# EAGLE design dual-basler-shield-v2 (EAGLE 9.2.2)
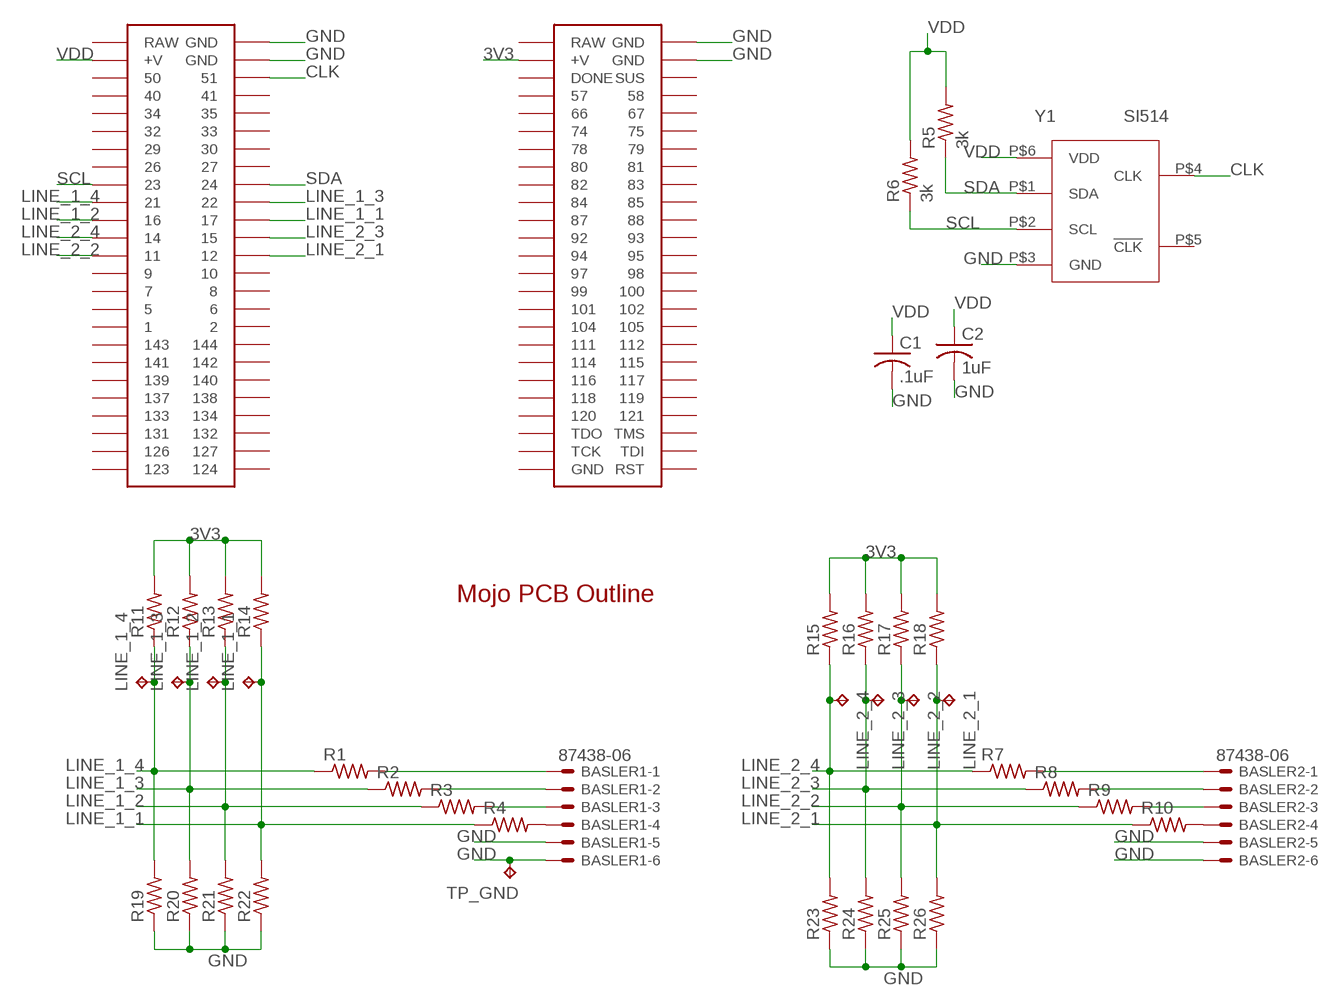
[diagram p0: schematic, sheet 1]

## Parts
BASLER1  87438-06  [87438-06]
BASLER2  87438-06  [87438-06]
C1  .1uF  C-USC0603  [C0603]
C2  1uF  C-USC0603  [C0603]
LINE_1_1  TPTP16R  [TP16R]
LINE_1_2  TPTP16R  [TP16R]
LINE_1_3  TPTP16R  [TP16R]
LINE_1_4  TPTP16R  [TP16R]
LINE_2_1  TPTP16R  [TP16R]
LINE_2_2  TPTP16R  [TP16R]
LINE_2_3  TPTP16R  [TP16R]
LINE_2_4  TPTP16R  [TP16R]
R1  R-US_R0603  [R0603]
R2  R-US_R0603  [R0603]
R3  R-US_R0603  [R0603]
R4  R-US_R0603  [R0603]
R5  3k  R-US_R0603  [R0603]
R6  3k  R-US_R0603  [R0603]
R7  R-US_R0603  [R0603]
R8  R-US_R0603  [R0603]
R9  R-US_R0603  [R0603]
R10  R-US_R0603  [R0603]
R11  R-US_R0603  [R0603]
R12  R-US_R0603  [R0603]
R13  R-US_R0603  [R0603]
R14  R-US_R0603  [R0603]
R15  R-US_R0603  [R0603]
R16  R-US_R0603  [R0603]
R17  R-US_R0603  [R0603]
R18  R-US_R0603  [R0603]
R19  R-US_R0603  [R0603]
R20  R-US_R0603  [R0603]
R21  R-US_R0603  [R0603]
R22  R-US_R0603  [R0603]
R23  R-US_R0603  [R0603]
R24  R-US_R0603  [R0603]
R25  R-US_R0603  [R0603]
R26  R-US_R0603  [R0603]
TP_GND  TPTP16R  [TP16R]
U$3  MOJO_OUTLINE  [MOJO_OUTLINE]
U$4  MOJOV3  [MOJO_V3]
Y1  SI514  [XTAL-6PIN]

## Nets
3V3: R11.2 R12.2 R13.2 R14.2 R15.2 R16.2 R17.2 R18.2 U$4.V@2(+V)
CLK: U$4.51 Y1.P$4(CLK)
GND: BASLER1.5 BASLER1.6 BASLER2.5 BASLER2.6 C1.2 C2.2 R19.1 R20.1 R21.1 R22.1 R23.1 R24.1 R25.1 R26.1 TP_GND.TP U$4.GND@1(GND) U$4.GND@2(GND) U$4.GND@3(GND) U$4.GND@4(GND) Y1.P$3(GND)
LINE_1_1: LINE_1_1.TP R4.1 R14.1 R22.2 U$4.17
LINE_1_2: LINE_1_2.TP R3.1 R13.1 R21.2 U$4.16
LINE_1_3: LINE_1_3.TP R2.1 R12.1 R20.2 U$4.22
LINE_1_4: LINE_1_4.TP R1.1 R11.1 R19.2 U$4.21
LINE_2_1: LINE_2_1.TP R10.1 R18.1 R26.2 U$4.12
LINE_2_2: LINE_2_2.TP R9.1 R17.1 R25.2 U$4.11
LINE_2_3: LINE_2_3.TP R8.1 R16.1 R24.2 U$4.15
LINE_2_4: LINE_2_4.TP R7.1 R15.1 R23.2 U$4.14
N$1: BASLER1.1 R1.2
N$2: BASLER1.2 R2.2
N$3: BASLER1.3 R3.2
N$4: BASLER1.4 R4.2
N$5: BASLER2.1 R7.2
N$6: BASLER2.2 R8.2
N$7: BASLER2.3 R9.2
N$8: BASLER2.4 R10.2
SCL: R6.1 U$4.23 Y1.P$2(SCL)
SDA: R5.1 U$4.24 Y1.P$1(SDA)
VDD: C1.1 C2.1 R5.2 R6.2 U$4.V@1(+V) Y1.P$6(VDD)
Unconnected: U$4.1 U$4.2 U$4.5 U$4.6 U$4.7 U$4.8 U$4.9 U$4.10 U$4.26 U$4.27 U$4.29 U$4.30 U$4.32 U$4.33 U$4.34 U$4.35 U$4.40 U$4.41 U$4.50 U$4.57 U$4.58 U$4.66 U$4.67 U$4.74 U$4.75 U$4.78 U$4.79 U$4.80 U$4.81 U$4.82 U$4.83 U$4.84 U$4.85 U$4.87 U$4.88 U$4.92 U$4.93 U$4.94 U$4.95 U$4.97 U$4.98 U$4.99 U$4.100 U$4.101 U$4.102 U$4.104 U$4.105 U$4.111 U$4.112 U$4.114 U$4.115 U$4.116 U$4.117 U$4.118 U$4.119 U$4.120 U$4.121 U$4.123 U$4.124 U$4.126 U$4.127 U$4.131 U$4.132 U$4.133 U$4.134 U$4.137 U$4.138 U$4.139 U$4.140 U$4.141 U$4.142 U$4.143 U$4.144 U$4.A0 U$4.A1 U$4.A4 U$4.A5 U$4.A6 U$4.A7 U$4.A8 U$4.A9 U$4.AREF U$4.DONE U$4.GND@5(GND) U$4.GND@6(GND) U$4.RAW@1(RAW) U$4.RAW@2(RAW) U$4.RST U$4.SUS U$4.TCK U$4.TDI U$4.TDO U$4.TMS Y1.P$5(!CLK)

## Library data of the parts
BASLER1 BASLER2 = con-molex:87438-06: Wire-to-Board 1.50mm (.059") Pitch Header - Right Angle, SMT, Shrouded Source: http://www.molex.com/product/micro/87438.html; MF: MOLEX; MPN: 87438-0643; OC_FARNELL: 1756938; OC_NEWARK: 88K3155
C1 C2 = rcl:C-US: CAPACITOR, American symbol; SPICEPREFIX: C
LINE_1_1-LINE_1_4 LINE_2_1-LINE_2_4 TP_GND = testpad:TP: Test pad
R1-R26 = rcl:R-US_: RESISTOR, American symbol; SPICEPREFIX: R
U$3 = EmbeddedMicro-Mojo:MOJO_OUTLINE
U$4 = EmbeddedMicro-Mojo:MOJO
Y1 = lupa300-components:SI514

## Board
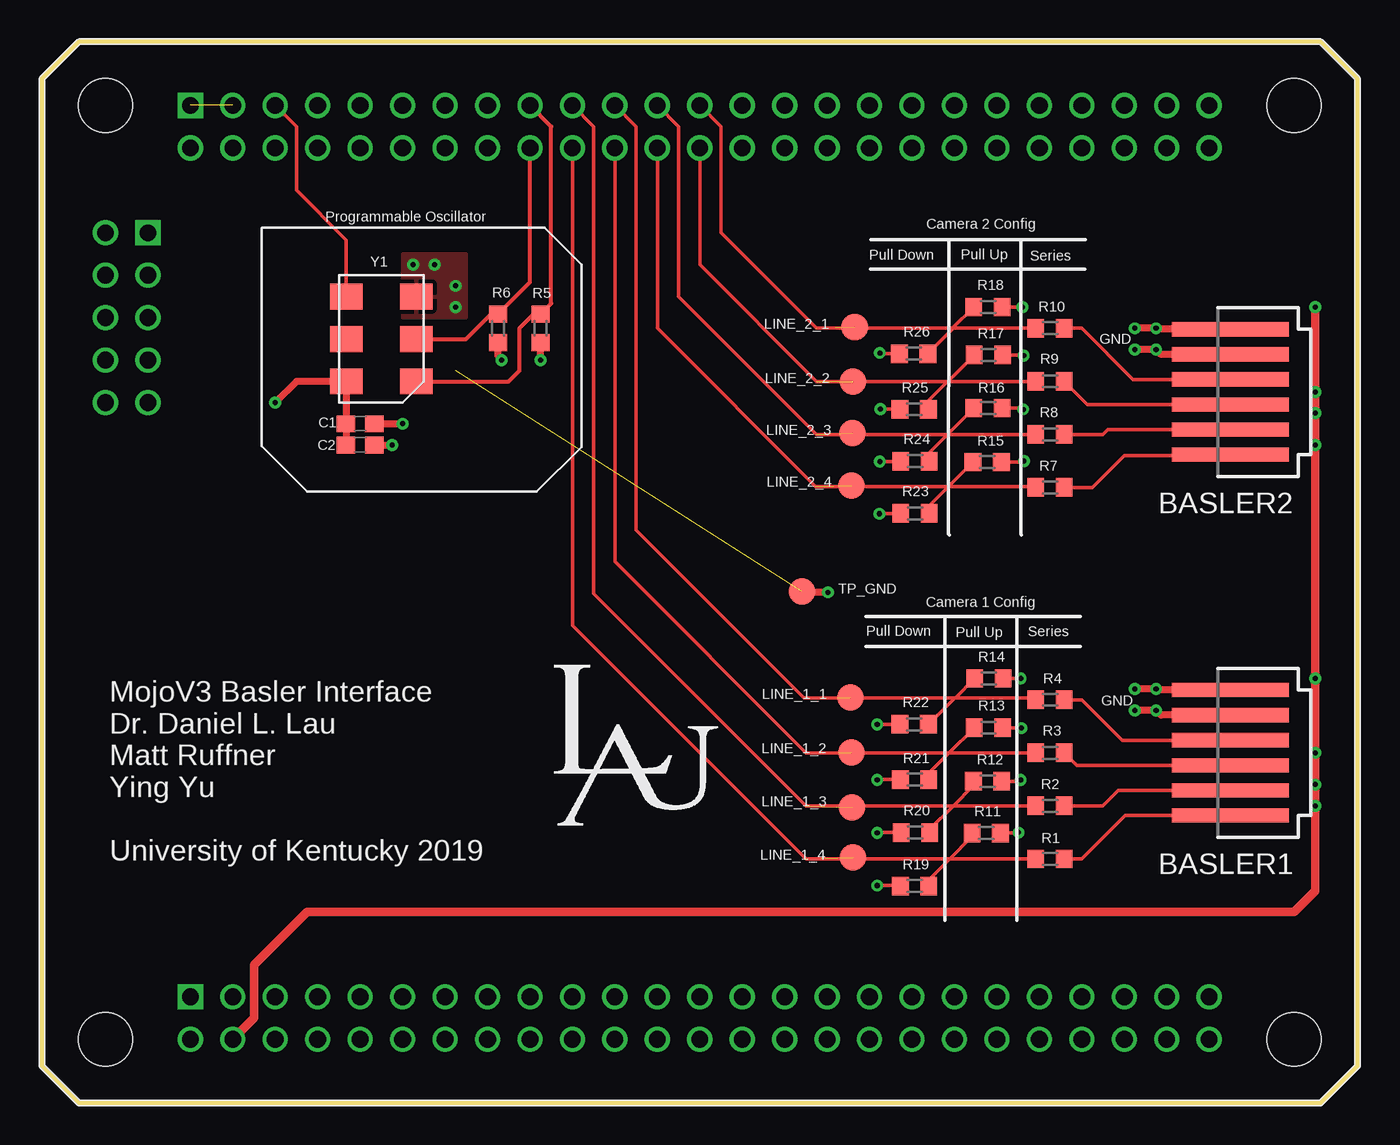
[diagram p1: board, top side]
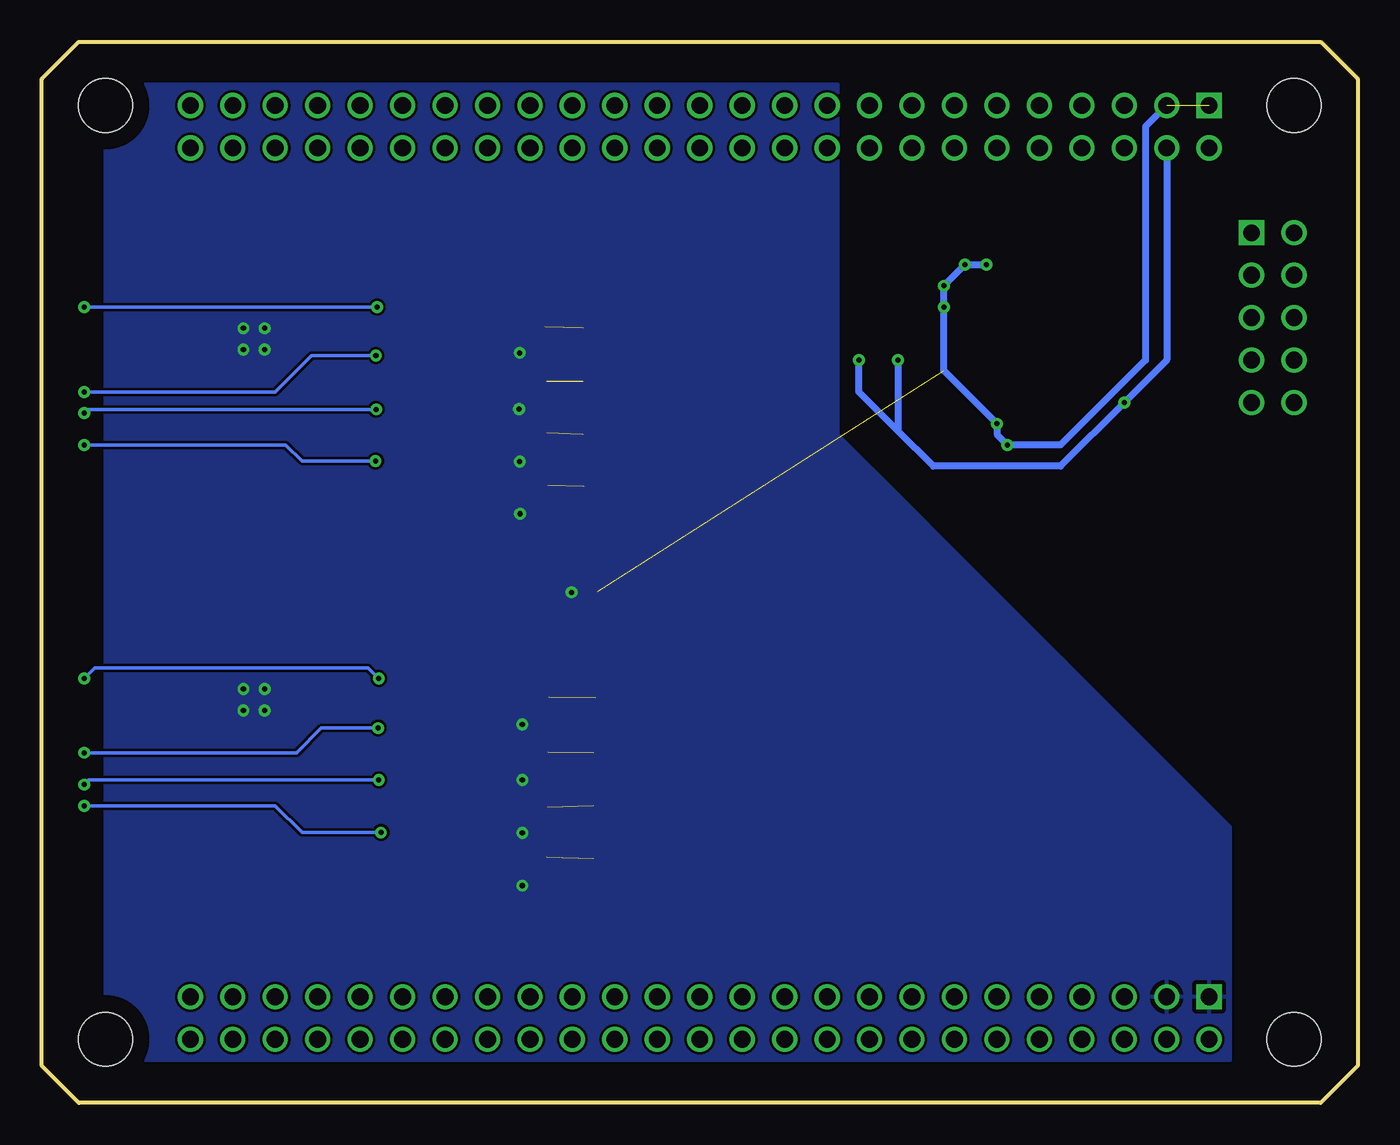
[diagram p2: board, bottom side, seen from below]

Size 78.74 x 63.5 mm. Coordinates in mm from the lower left corner, seen from the top.
Outline: 2.22,0 76.52,0 78.74,2.22 78.74,61.28 76.52,63.5 2.22,63.5 0,61.28 0,2.22 2.22,0
Copper layers (1*16): Top 0.035mm / dielectric 1.5mm / Bottom 0.035mm
Design rules "default *": minimum track width 6mil, minimum drill 0.35mm, track to track 6mil, track to pad 6mil, pad to pad 6mil, via to via 6mil, smd to smd 6mil, copper to edge 40mil, drill to drill 6mil, minimum pad ring 10mil, minimum via ring 8mil, stop-mask expansion 4mil, vias tented up to drill 12mil, thermal gap 10mil

### Footprints (pad centres in the part's own frame; a part is rotated, then mirrored left to right if it is on the bottom)
87438-06 = smd 7 x 0.85: 1 0,3.75; 2 0,2.25; 3 0,0.75; 4 0,-0.75; 5 0,-2.25; 6 0,-3.75
C0603 = smd 1.1 x 1: 1 -0.85,0; 2 0.85,0
TP16R = smd 1.6 x 1.6: TP 0,0
R0603 = smd 1 x 1.1: 1 -0.85,0; 2 0.85,0
MOJO_V3 = drill 1: 1 49.53,57.15; 2 49.53,59.69; 5 46.99,57.15; 6 46.99,59.69; 7 44.45,57.15; 8 44.45,59.69; 9 41.91,57.15; 10 41.91,59.69; 11 39.37,57.15; 12 39.37,59.69; 14 36.83,57.15; 15 36.83,59.69; 16 34.29,57.15; 17 34.29,59.69; 21 31.75,57.15; 22 31.75,59.69; 23 29.21,57.15; 24 29.21,59.69; 26 26.67,57.15; 27 26.67,59.69; 29 24.13,57.15; 30 24.13,59.69; 32 21.59,57.15; 33 21.59,59.69; 34 19.05,57.15; 35 19.05,59.69; 40 16.51,57.15; 41 16.51,59.69; 50 13.97,57.15; 51 13.97,59.69; 57 16.51,3.81; 58 16.51,6.35; 66 19.05,3.81; 67 19.05,6.35; 74 21.59,3.81; 75 21.59,6.35; 78 24.13,3.81; 79 24.13,6.35; 80 26.67,3.81; 81 26.67,6.35; 82 29.21,3.81; 83 29.21,6.35; 84 31.75,3.81; 85 31.75,6.35; 87 34.29,3.81; 88 34.29,6.35; 92 36.83,3.81; 93 36.83,6.35; 94 39.37,3.81; 95 39.37,6.35; 97 41.91,3.81; 98 41.91,6.35; 99 44.45,3.81; 100 44.45,6.35; 101 46.99,3.81; 102 46.99,6.35; 104 49.53,3.81; 105 49.53,6.35; 111 52.07,3.81; 112 52.07,6.35; 114 54.61,3.81; 115 54.61,6.35; 116 57.15,3.81; 117 57.15,6.35; 118 59.69,3.81; 119 59.69,6.35; 120 62.23,3.81; 121 62.23,6.35; 123 69.85,57.15; 124 69.85,59.69; 126 67.31,57.15; 127 67.31,59.69; 131 64.77,57.15; 132 64.77,59.69; 133 62.23,57.15; 134 62.23,59.69; 137 59.69,57.15; 138 59.69,59.69; 139 57.15,57.15; 140 57.15,59.69; 141 54.61,57.15; 142 54.61,59.69; 143 52.07,57.15; 144 52.07,59.69; A0 6.35,41.91; A1 3.81,41.91; A4 6.35,44.45; A5 3.81,44.45; A6 6.35,46.99; A7 3.81,46.99; A8 6.35,49.53; A9 3.81,49.53; AREF 3.81,52.07; DONE 13.97,3.81; GND@2 11.43,59.69; GND@4 11.43,6.35; GND@6 69.85,3.81; RAW@1 8.89,57.15; RAW@2 8.89,3.81; RST 69.85,6.35; SUS 13.97,6.35; TCK 67.31,3.81; TDI 67.31,6.35; TDO 64.77,3.81; TMS 64.77,6.35; V@1 11.43,57.15; V@2 11.43,3.81 | drill 1 square: GND@1 8.89,59.69; GND@3 8.89,6.35; GND@5 6.35,52.07 | hole 3.2: 3.81,3.81; 3.81,59.69; 74.93,59.69; 74.93,3.81
XTAL-6PIN = smd 1.95 x 1.55: P$1 -2.1,2.54; P$2 -2.1,0; P$3 -2.1,-2.54; P$4 2.1,-2.54; P$5 2.1,0; P$6 2.1,2.54

### Placement (x,y rotation side)
BASLER1  71.12,20.95 180 top
BASLER2  71.12,42.55 180 top
C1  19.05,40.64 0 top
C2  19.05,39.37 0 top
LINE_1_1  48.39,24.26 0 top
LINE_1_2  48.44,20.98 0 top
LINE_1_3  48.46,17.68 0 top
LINE_1_4  48.54,14.68 0 top
LINE_2_1  48.64,46.43 0 top
LINE_2_2  48.54,43.18 0 top
LINE_2_3  48.51,40.08 0 top
LINE_2_4  48.44,36.96 0 top
R1  60.33,14.61 0 top
R2  60.33,17.78 0 top
R3  60.33,20.95 0 top
R4  60.33,24.13 0 top
R5  29.84,46.35 270 top
R6  27.3,46.35 270 top
R7  60.33,36.83 0 top
R8  60.33,40.01 0 top
R9  60.33,43.18 0 top
R10  60.33,46.35 0 top
R11  56.52,16.15 0 top
R12  56.59,19.25 0 top
R13  56.64,22.45 0 top
R14  56.67,25.4 0 top
R15  56.57,38.35 0 top
R16  56.62,41.58 0 top
R17  56.64,44.76 0 top
R18  56.62,47.62 0 top
R19  52.22,12.98 0 top
R20  52.27,16.18 0 top
R21  52.22,19.36 0 top
R22  52.2,22.66 0 top
R23  52.25,35.28 0 top
R24  52.25,38.41 0 top
R25  52.2,41.5 0 top
R26  52.17,44.83 0 top
TP_GND  45.49,30.61 0 top
U$3  0,0 0 top
U$4  0,0 0 top
Y1  20.32,45.72 180 top

### Tracks (layer width: path | path; a pad name or v marks a point on that pad's centre or on a via)
3V3  (via drill 0.3)
  Top 0.203: v58.67,47.62 R18.2 | R14.2 v58.57,25.4 | R13.2 58.6,22.45 v58.62,22.43 | R12.2 58.5,19.25 v58.57,19.33 | R11.2 58.42,16.15 v58.45,16.18 | R17.2 58.73,44.76 v58.75,44.73 | R16.2 58.65,41.58 v58.73,41.5 | R15.2 58.73,38.35 v58.78,38.41
  Top 0.508: U$4.V@2 12.7,5.08 12.7,8.26 15.88,11.43 74.93,11.43 76.2,12.7 v76.2,17.78 v76.2,19.05 v76.2,20.95 v76.2,25.4 v76.2,39.37 v76.2,41.27 v76.2,42.55 v76.2,47.62
  Bottom 0.203: v76.2,47.62 v58.67,47.62 | v58.75,44.73 62.59,44.73 64.77,42.55 v76.2,42.55 | v76.2,41.27 75.97,41.5 v58.73,41.5 | v76.2,39.37 64.14,39.37 63.17,38.41 v58.78,38.41 | v58.57,25.4 59.21,26.04 75.56,26.04 v76.2,25.4 | v58.62,22.43 62.03,22.43 63.5,20.95 v76.2,20.95 | v76.2,19.05 75.92,19.33 v58.57,19.33 | v58.45,16.18 63.17,16.18 64.77,17.78 v76.2,17.78
CLK
  Top 0.203: Y1.P$4 18.22,51.63 15.24,54.61 15.24,58.42 U$4.51
GND  (via drill 0.3)  (2 unrouted)
  Top 0.203: R26.1 50.19,44.83 v50.14,44.88 | R23.1 50.14,35.28 v50.11,35.26 | R24.1 51.37,38.38 v50.14,38.38 | R25.1 51.32,41.53 v50.19,41.53 | R22.1 v49.99,22.66 | R21.1 50.01,19.36 v49.99,19.33 | R20.1 50.01,16.18 v49.99,16.15 | R19.1 51.35,13.01 v49.99,13.01
  Top 0.406: C1.2 v21.59,40.64 | C2.2 v20.95,39.37 | BASLER2.6 66.73,46.3 v66.67,46.35 v65.41,46.35 | BASLER2.5 66.97,44.8 v66.67,45.09 v65.41,45.09 | BASLER1.6 66.73,24.7 v66.67,24.77 v65.41,24.77 | BASLER1.5 66.97,23.2 v66.67,23.5 v65.41,23.5 | v47.04,30.56 46.15,30.56 46.1,30.61 TP_GND.TP
  Bottom 0.406: U$4.GND@2 12.7,58.42 12.7,44.45 17.78,39.37 v20.95,39.37 21.59,40.01 v21.59,40.64 24.77,43.81 v24.77,47.62 v24.77,48.9 v23.5,50.16 v22.23,50.16
  pour Top: 21.59,46.99 25.4,46.99 25.4,50.8 21.59,50.8
  pour Bottom: 7.62,16.51 7.62,2.54 74.93,2.54 74.93,60.96 31.11,60.96 31.11,40.01
LINE_1_1  (1 unrouted)
  Top 0.203: U$4.17 35.56,58.42 35.56,34.29 45.6,24.25 54.63,24.25 | R4.1 59.36,24.25 54.66,24.25 | R14.1 54.66,24.25 | R22.2 54.63,24.25 | 54.63,24.25 54.66,24.25
LINE_1_2  (1 unrouted)
  Top 0.203: U$4.16 34.29,32.38 45.72,20.95 54.29,20.95 | R3.1 54.29,20.95 | R13.1 54.29,20.95 | R21.2 53.07,19.73 54.29,20.95
LINE_1_3  (1 unrouted)
  Top 0.203: U$4.22 33.02,58.42 33.02,30.48 45.72,17.78 54.53,17.78 | R2.1 54.53,17.78 | R12.1 55.74,18.99 54.53,17.78 | R20.2 53.12,16.37 54.53,17.78
LINE_1_4  (1 unrouted)
  Top 0.203: U$4.21 31.75,28.57 45.72,14.61 54.33,14.61 | R1.1 54.33,14.61 | R11.1 55.66,15.94 54.33,14.61 | R19.2 53.07,13.35 54.33,14.61
LINE_2_1  (1 unrouted)
  Top 0.203: U$4.12 40.64,58.42 40.64,52.07 46.35,46.35 54.5,46.35 | R10.1 54.5,46.35 | R18.1 54.5,46.35 | R26.2 54.5,46.31 54.5,46.35
LINE_2_2  (1 unrouted)
  Top 0.203: U$4.11 39.37,50.16 46.35,43.18 54.2,43.18 | R9.1 54.22,43.18 | R17.1 54.22,43.18 | 54.22,43.18 54.2,43.18 | R25.2 53.05,42.02 54.2,43.18
LINE_2_3  (1 unrouted)
  Top 0.203: U$4.15 38.1,58.42 38.1,48.26 46.35,40.01 54.19,40.01 | R8.1 54.19,40.01 | R16.1 54.19,40.01 | R24.2 53.1,38.91 54.19,40.01
LINE_2_4  (1 unrouted)
  Top 0.203: U$4.14 36.83,46.35 46.3,36.89 54.25,36.89 | R7.1 59.41,36.89 54.25,36.89 | R15.1 54.25,36.89 | R23.2 53.1,35.74 54.25,36.89
N$1
  Top 0.203: BASLER1.1 64.83,17.2 62.23,14.61 R1.2
N$2
  Top 0.203: BASLER1.2 64.42,18.7 63.5,17.78 R2.2
N$3
  Top 0.203: BASLER1.3 61.92,20.2 R3.2
N$4
  Top 0.203: BASLER1.4 64.66,21.7 62.23,24.13 R4.2
N$5
  Top 0.203: BASLER2.1 71.06,38.73 64.77,38.73 62.87,36.83 R7.2
N$6
  Top 0.203: BASLER2.2 63.79,40.3 63.5,40.01 R8.2
N$7
  Top 0.203: BASLER2.3 62.56,41.8 R9.2
N$8
  Top 0.203: BASLER2.4 65.29,43.3 62.23,46.35 R10.2
SCL
  Top 0.254: Y1.P$2 25.4,45.72 26.89,47.2 R6.1 29.21,49.11 U$4.23
SDA
  Top 0.203: Y1.P$1 22.84,42.76
  Top 0.254: Y1.P$1 27.94,43.18 28.57,43.81 28.57,46.35 29.43,47.2 R5.1 30.48,47.84 30.48,58.42 U$4.24
VDD  (via drill 0.3)
  Top 0.406: v13.97,41.91 15.24,43.18 Y1.P$6 18.22,40.66 C1.1 C2.1 | v29.84,44.45 R5.2 | v27.52,44.45 27.3,44.66 R6.2
  Bottom 0.406: U$4.V@1 11.43,44.45 v13.97,41.91 17.78,38.1 25.4,38.1 27.52,40.22 | v27.52,44.45 27.52,40.22 | 27.52,40.22 29.84,42.55 v29.84,44.45

### Text on the board
tNames: Programmable Oscillator | Camera 2 Config | Pull Down | Pull Up | Series | GND | Camera 1 Config | Pull Down | Pull Up | Series | GND | MojoV3 Basler Interface / Dr. Daniel L. Lau / Matt Ruffner / Ying Yu / / University of Kentucky 2019